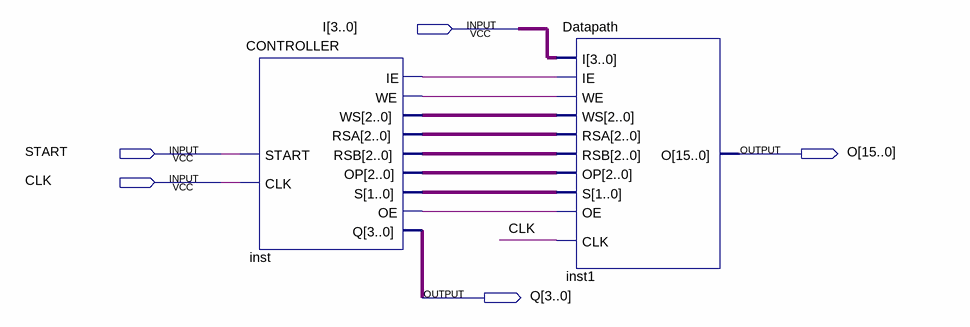
[diagram p0: schematic sheet]
// Quartus schematic LAB4_5_6.bdf as structural Verilog: 2 symbols, 5 pins
module LAB4_5_6 (
  input  [3:0] I,
  input  START,
  input  CLK,
  output [15:0] O,
  output [3:0] Q
);

  wire inst_ie, inst_oe, inst_we;
  wire [1:0] inst_s;
  wire [2:0] inst_op, inst_rsa, inst_rsb, inst_ws;

  CONTROLLER inst (
    .START(START), .CLK(CLK), .IE(inst_ie), .WE(inst_we), .WS(inst_ws), .RSA(inst_rsa), .RSB(inst_rsb),
    .OP(inst_op), .S(inst_s), .OE(inst_oe), .Q(Q));
  Datapath inst1 (
    .I(I), .IE(inst_ie), .RSA(inst_rsa), .WS(inst_ws), .WE(inst_we), .RSB(inst_rsb), .CLK(CLK), .OP(inst_op),
    .S(inst_s), .OE(inst_oe), .O(O));
endmodule
